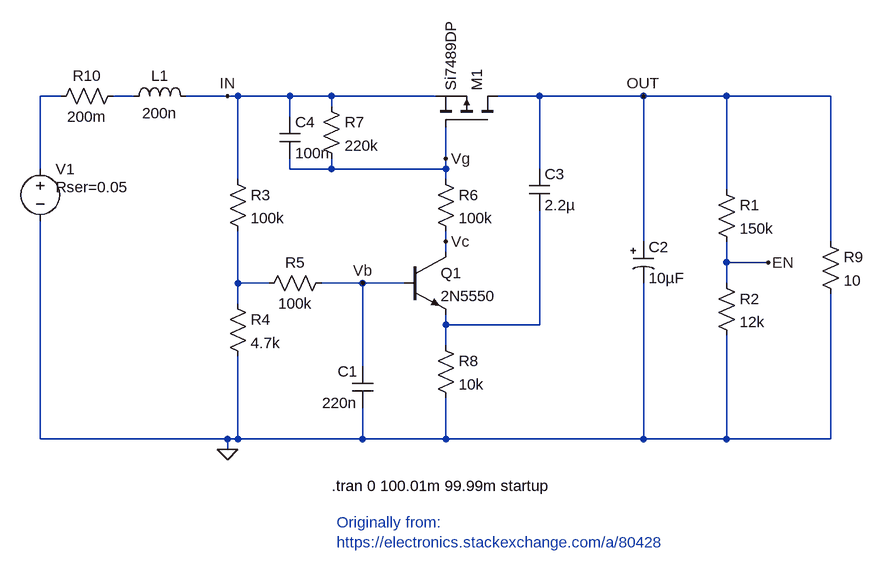
[diagram p0: schematic input_hot_swap.asc]
input_hot_swap.asc, the LTspice schematic file:
Version 4
SHEET 1 1080 748
WIRE -160 48 -192 48
WIRE -48 48 -80 48
WIRE 96 48 32 48
WIRE 112 48 96 48
WIRE 192 48 112 48
WIRE 256 48 192 48
WIRE 416 48 256 48
WIRE 576 48 512 48
WIRE 736 48 576 48
WIRE 864 48 736 48
WIRE 1024 48 864 48
WIRE 256 64 256 48
WIRE 192 80 192 48
WIRE 432 144 432 96
WIRE -192 160 -192 48
WIRE 192 160 192 144
WIRE 256 160 256 144
WIRE 256 160 192 160
WIRE 432 160 432 144
WIRE 432 160 256 160
WIRE 576 160 576 48
WIRE 112 176 112 48
WIRE 432 176 432 160
WIRE 864 192 864 48
WIRE 432 272 432 256
WIRE 736 272 736 48
WIRE 1024 272 1024 48
WIRE 432 288 432 272
WIRE 864 304 864 272
WIRE 928 304 864 304
WIRE 112 336 112 256
WIRE 160 336 112 336
WIRE 304 336 240 336
WIRE 368 336 304 336
WIRE 864 336 864 304
WIRE 112 368 112 336
WIRE 432 400 432 384
WIRE 576 400 576 224
WIRE 576 400 432 400
WIRE 432 432 432 400
WIRE 304 464 304 336
WIRE -192 576 -192 240
WIRE 96 576 -192 576
WIRE 112 576 112 448
WIRE 112 576 96 576
WIRE 304 576 304 528
WIRE 304 576 112 576
WIRE 432 576 432 512
WIRE 432 576 304 576
WIRE 736 576 736 336
WIRE 736 576 432 576
WIRE 864 576 864 416
WIRE 864 576 736 576
WIRE 1024 576 1024 352
WIRE 1024 576 864 576
WIRE 96 592 96 576
FLAG 96 592 0
FLAG 928 304 EN
FLAG 96 48 IN
FLAG 736 48 OUT
FLAG 432 144 Vg
FLAG 432 272 Vc
FLAG 304 336 Vb
SYMBOL res 848 176 R0
SYMATTR InstName R1
SYMATTR Value 150k
SYMBOL res 848 320 R0
SYMATTR InstName R2
SYMATTR Value 12k
SYMBOL voltage -192 144 R0
WINDOW 3 24 44 Invisible 2
WINDOW 123 0 0 Left 0
WINDOW 39 24 44 Left 2
SYMATTR Value PULSE(0 50 0.1 1n 1n 10 20)
SYMATTR SpiceLine Rser=0.05
SYMATTR InstName V1
SYMBOL pmos 512 96 M270
SYMATTR InstName M1
SYMATTR Value Si7489DP
SYMBOL res 96 160 R0
SYMATTR InstName R3
SYMATTR Value 100k
SYMBOL res 96 352 R0
SYMATTR InstName R4
SYMATTR Value 4.7k
SYMBOL res 256 320 R90
WINDOW 0 0 56 VBottom 2
WINDOW 3 32 56 VTop 2
SYMATTR InstName R5
SYMATTR Value 100k
SYMBOL cap 320 528 R180
WINDOW 0 24 56 Left 2
WINDOW 3 24 8 Left 2
SYMATTR InstName C1
SYMATTR Value 220n
SYMBOL npn 368 288 R0
SYMATTR InstName Q1
SYMATTR Value 2N5550
SYMBOL res 416 160 R0
SYMATTR InstName R6
SYMATTR Value 100k
SYMBOL res 240 48 R0
SYMATTR InstName R7
SYMATTR Value 220k
SYMBOL res 416 416 R0
SYMATTR InstName R8
SYMATTR Value 10k
SYMBOL polcap 720 272 R0
WINDOW 3 24 56 Left 2
SYMATTR Value 10µF
SYMATTR InstName C2
SYMATTR Description Capacitor
SYMATTR Type cap
SYMATTR SpiceLine V=100 Irms=3 Rser=.005 Lser=0
SYMBOL cap 560 160 R0
SYMATTR InstName C3
SYMATTR Value 2.2µ
SYMATTR SpiceLine Rser=2m
SYMBOL res 1008 256 R0
SYMATTR InstName R9
SYMATTR Value 10
SYMBOL cap 176 80 R0
SYMATTR InstName C4
SYMATTR Value 100n
SYMBOL res -64 32 R90
WINDOW 0 0 56 VBottom 2
WINDOW 3 32 56 VTop 2
SYMATTR InstName R10
SYMATTR Value 200m
SYMBOL ind -64 64 R270
WINDOW 0 32 56 VTop 2
WINDOW 3 5 56 VBottom 2
SYMATTR InstName L1
SYMATTR Value 200n
TEXT 256 648 Left 2 !.tran 0 100.01m 99.99m startup
TEXT 264 704 Left 2 ;Originally from:\nhttps://electronics.stackexchange.com/a/80428

The netlist it stands for:
* input_hot_swap.asc
R1 OUT EN 150k
R2 EN 0 12k
V1 N001 0 PULSE(0 50 0.1 1n 1n 10 20) Rser=0.05
M1 OUT Vg IN IN Si7489DP
R3 IN N003 100k
R4 N003 0 4.7k
R5 Vb N003 100k
C1 0 Vb 220n
Q1 Vc Vb N004 0 2N5550
R6 Vg Vc 100k
R7 IN Vg 220k
R8 N004 0 10k
C2 OUT 0 10µF V=100 Irms=3 Rser=.005 Lser=0
C3 OUT N004 2.2µ Rser=2m
R9 OUT 0 10
C4 IN Vg 100n
R10 N002 N001 200m
L1 N002 IN 200n
.model NPN NPN
.model PNP PNP
.lib standard.bjt
.model NMOS NMOS
.model PMOS PMOS
.lib standard.mos
.tran 0 100.01m 99.99m startup
* Originally from:
* https://electronics.stackexchange.com/a/80428
.backanno
.end